# Altium schematic sheet ESP32.SchDoc
size A; SheetNumber: 3; SheetTotal: 6
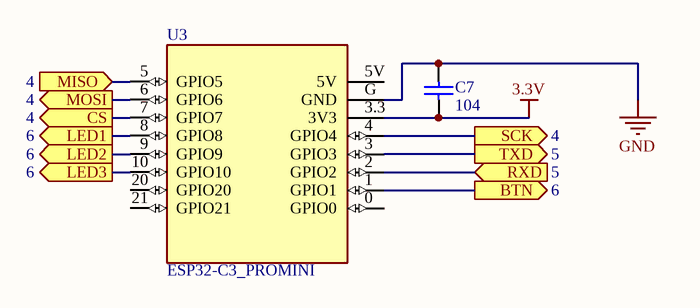
[diagram p0: ESP32.SchDoc]

## Parts
C7  104  [tu gom]
U3  ESP32-C3_PROMINI  [MODULE_ESP32-C3_SUPERMINI_TH]

## Ports
BTN (out, see 6), CS (out, see 4), LED1 (out, see 6), LED2 (out, see 6), LED3 (out, see 6), MISO (in, see 4), MOSI (out, see 4), RXD (in, see 5), SCK (out, see 4), TXD (out, see 5)

## Nets
3.3V: C7.1 U3.3.3(3V3)
GND: C7.2 U3.G(GND)
BTN: U3.1(GPIO1) ; port BTN
CS: U3.7(GPIO7) ; port CS
LED1: U3.8(GPIO8) ; port LED1
LED2: U3.9(GPIO9) ; port LED2
LED3: U3.10(GPIO10) ; port LED3
MISO: U3.5(GPIO5) ; port MISO
MOSI: U3.6(GPIO6) ; port MOSI
RXD: U3.2(GPIO2) ; port RXD
SCK: U3.4(GPIO4) ; port SCK
TXD: U3.3(GPIO3) ; port TXD

Not connected (* = marked no-connect by the designer): U3 0(GPIO0) 5V 20(GPIO20) 21(GPIO21)

## Library data of the parts
C7 = Tu gom 104 50V: Cắm; So_Chan: 2; Ten_Linh_Kien: Tụ gốm 104 100nF 50V; Don_Vi: Con; Ma_Hang: MH004761; Chung_Loai: Cắm; Kieu_Chan: *
U3 = ESP32-C3_SUPERMINI_TH: Super tiny ESP32-C3 board; MF: Espressif Systems; MP: ESP32-C3 SuperMini_TH; SnapEDA_Link: https://www.snapeda.com/parts/ESP32-C3%20SuperMini_TH/Espressif+Systems/view-part/?ref=snap; Package: Package; Value: *; Check_prices: https://www.snapeda.com/parts/ESP32-C3%20SuperMini_TH/Espressif+Systems/view-part/?ref=eda